# Altium schematic sheet LAUNCHXL-F28379D_6.SchDoc
size 301 x 239 mm
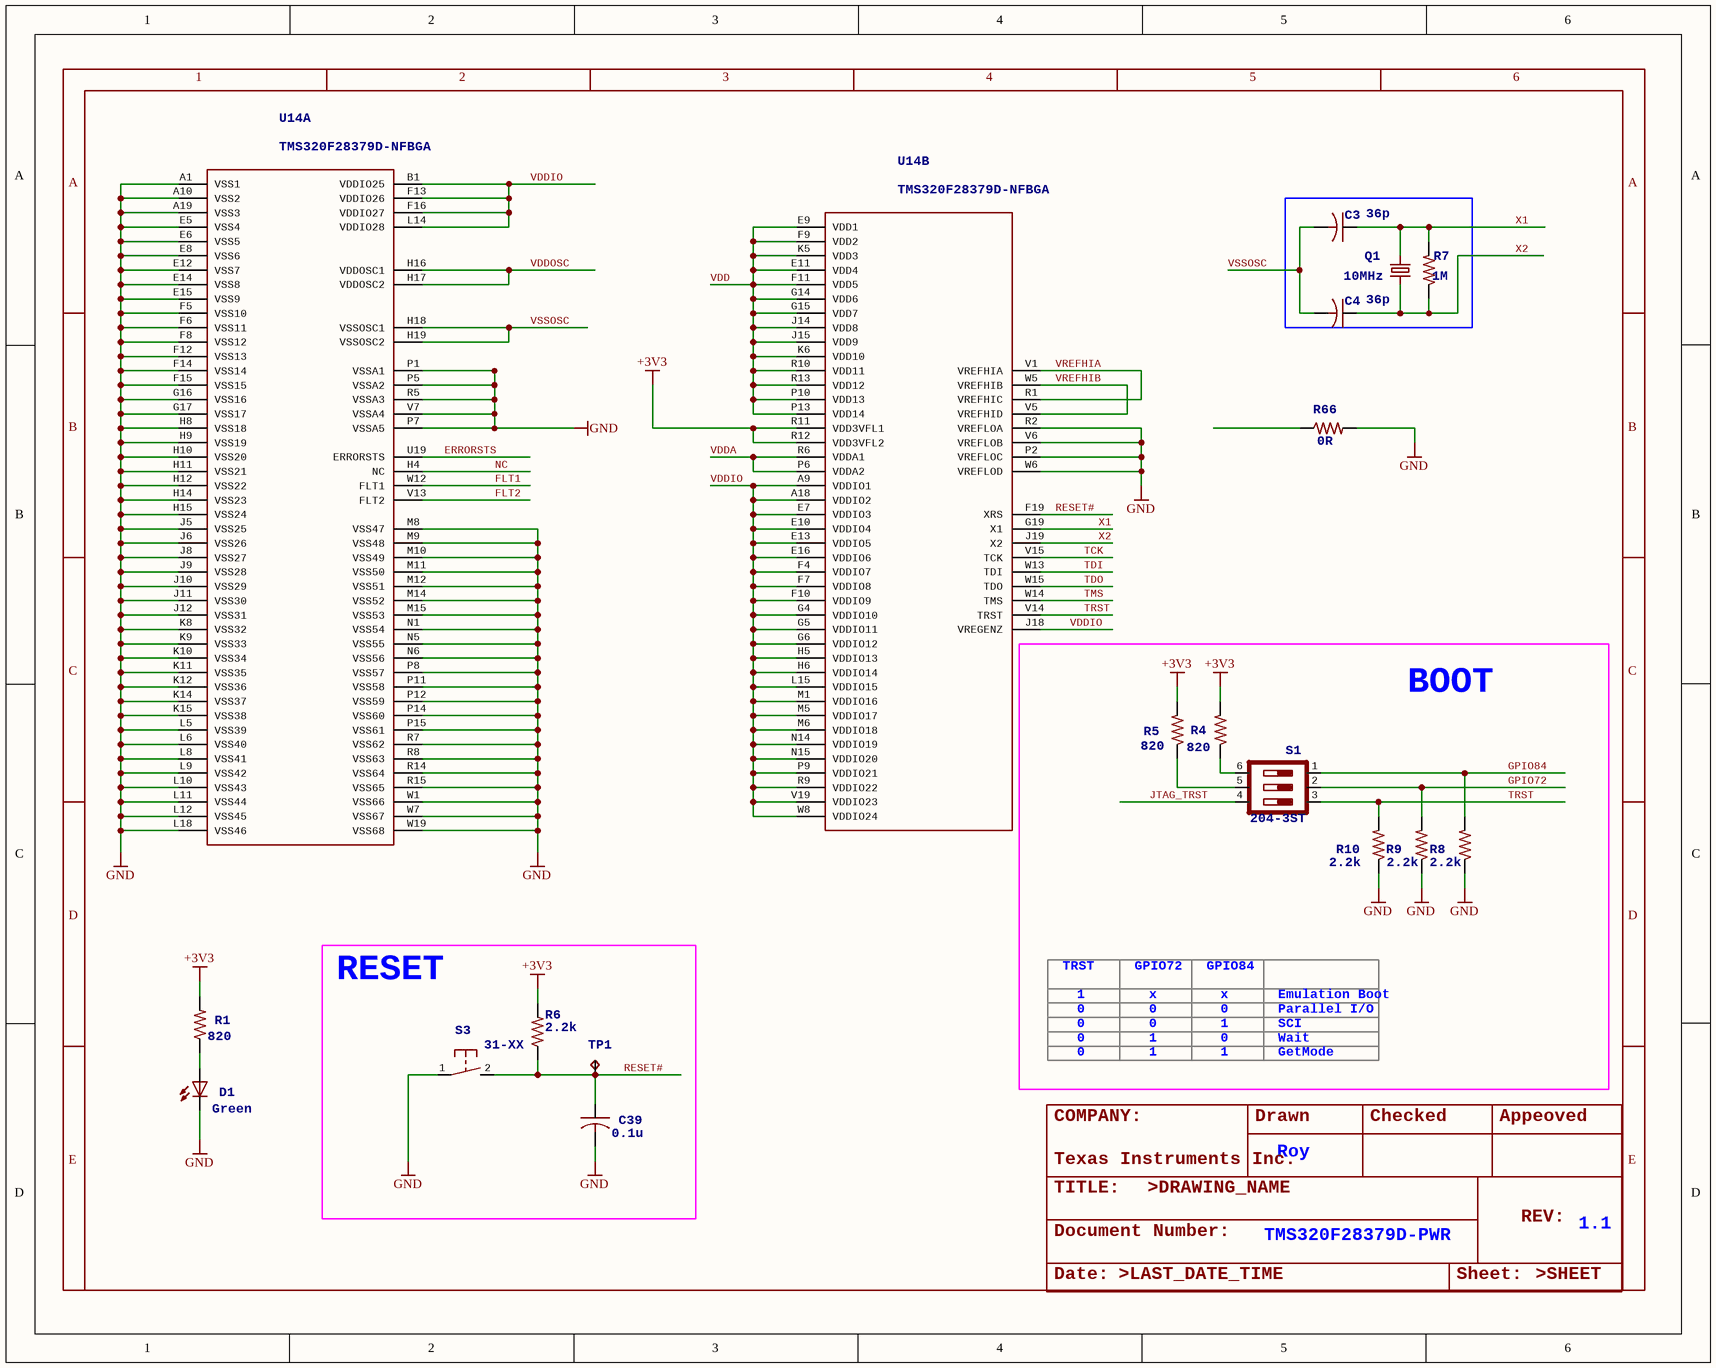
[diagram p0: LAUNCHXL-F28379D_6.SchDoc]

## Parts
C3  36p  [C0402]
C4  36p  [C0402]
C39  0.1u  [C0402]
D1  Green  [CHIP-LED0603]
Q1  10MHz  [HC49/S]
R1  820  [R0402]
R4  820  [R0402]
R5  820  [R0402]
R6  2.2k  [R0402]
R7  1M  [R0402]
R8  2.2k  [R0402]
R9  2.2k  [R0402]
R10  2.2k  [R0402]
R66  0R  [R0402]
S1  204-3ST  [CTS-219-03]
S3  31-XX  [B3F-31XX]
TP1  TESTPAD_TPB1,27  [TESTPAD_B1,27]  (value not drawn)
U14  TMS320F28379D-NFBGA  [BGA_F28079]  (parts A,B of 5)

## Blocks framed on the sheet
BOOT: R4 R5 R8-R10 S1
RESET: C39 R6 S3 TP1

## Nets
+3V3: R1.2 R4.2 R5.2 R6.2 U14.R11(VDD3VFL1) U14.R12(VDD3VFL2)
GND: C39.2 D1.C R8.1 R9.1 R10.1 R66.2 S3.1(P) U14.A1(VSS1) U14.A10(VSS2) U14.A19(VSS3) U14.E5(VSS4) U14.E6(VSS5) U14.E8(VSS6) U14.E12(VSS7) U14.E14(VSS8) U14.E15(VSS9) U14.F5(VSS10) U14.F6(VSS11) U14.F8(VSS12) U14.F12(VSS13) U14.F14(VSS14) U14.F15(VSS15) U14.G16(VSS16) U14.G17(VSS17) U14.H8(VSS18) U14.H9(VSS19) U14.H10(VSS20) U14.H11(VSS21) U14.H12(VSS22) U14.H14(VSS23) U14.H15(VSS24) U14.J5(VSS25) U14.J6(VSS26) U14.J8(VSS27) U14.J9(VSS28) U14.J10(VSS29) U14.J11(VSS30) U14.J12(VSS31) U14.K8(VSS32) U14.K9(VSS33) U14.K10(VSS34) U14.K11(VSS35) U14.K12(VSS36) U14.K14(VSS37) U14.K15(VSS38) U14.L5(VSS39) U14.L6(VSS40) U14.L8(VSS41) U14.L9(VSS42) U14.L10(VSS43) U14.L11(VSS44) U14.L12(VSS45) U14.L18(VSS46) U14.M8(VSS47) U14.M9(VSS48) U14.M10(VSS49) U14.M11(VSS50) U14.M12(VSS51) U14.M14(VSS52) U14.M15(VSS53) U14.N1(VSS54) U14.N5(VSS55) U14.N6(VSS56) U14.P1(VSSA1) U14.P2(VREFLOC) U14.P5(VSSA2) U14.P7(VSSA5) U14.P8(VSS57) U14.P11(VSS58) U14.P12(VSS59) U14.P14(VSS60) U14.P15(VSS61) U14.R2(VREFLOA) U14.R5(VSSA3) U14.R7(VSS62) U14.R8(VSS63) U14.R14(VSS64) U14.R15(VSS65) U14.V6(VREFLOB) U14.V7(VSSA4) U14.W1(VSS66) U14.W6(VREFLOD) U14.W7(VSS67) U14.W19(VSS68)
ERRORSTS: U14.U19(ERRORSTS)
FLT1: U14.W12(FLT1)
FLT2: U14.V13(FLT2)
GPIO72: R9.2 S1.2
GPIO84: R8.2 S1.1
JTAG_TRST: S1.4
NC: U14.H4(NC)
RESET#: C39.1 R6.1 S3.2(S) TP1.TP U14.F19(XRS)
TCK: U14.V15(TCK)
TDI: U14.W13(TDI)
TDO: U14.W15(TDO)
TMS: U14.W14(TMS)
TRST: R10.2 S1.3 U14.V14(TRST)
VDD: U14.E9(VDD1) U14.E11(VDD4) U14.F9(VDD2) U14.F11(VDD5) U14.G14(VDD6) U14.G15(VDD7) U14.J14(VDD8) U14.J15(VDD9) U14.K5(VDD3) U14.K6(VDD10) U14.P10(VDD13) U14.P13(VDD14) U14.R10(VDD11) U14.R13(VDD12)
VDDA: U14.P6(VDDA2) U14.R6(VDDA1)
VDDIO: U14.A9(VDDIO1) U14.A18(VDDIO2) U14.B1(VDDIO25) U14.E7(VDDIO3) U14.E10(VDDIO4) U14.E13(VDDIO5) U14.E16(VDDIO6) U14.F4(VDDIO7) U14.F7(VDDIO8) U14.F10(VDDIO9) U14.F13(VDDIO26) U14.F16(VDDIO27) U14.G4(VDDIO10) U14.G5(VDDIO11) U14.G6(VDDIO12) U14.H5(VDDIO13) U14.H6(VDDIO14) U14.J18(VREGENZ) U14.L14(VDDIO28) U14.L15(VDDIO15) U14.M1(VDDIO16) U14.M5(VDDIO17) U14.M6(VDDIO18) U14.N14(VDDIO19) U14.N15(VDDIO20) U14.P9(VDDIO21) U14.R9(VDDIO22) U14.V19(VDDIO23) U14.W8(VDDIO24)
VDDOSC: U14.H16(VDDOSC1) U14.H17(VDDOSC2)
VREFHIA: U14.R1(VREFHIC) U14.V1(VREFHIA)
VREFHIB: U14.V5(VREFHID) U14.W5(VREFHIB)
VSSOSC: C3.2 C4.2 U14.H18(VSSOSC1) U14.H19(VSSOSC2)
X1: C3.1 Q1.2 R7.2 U14.G19(X1)
X2: C4.1 Q1.1 R7.1 U14.J19(X2)
NetD1_A: D1.A R1.1
NetR4_1: R4.1 S1.6
NetR5_1: R5.1 S1.5

Not connected (* = marked no-connect by the designer): R66 1

## Notes on the sheet
- TRST
- 1
- 0
- GPIO72
- x
- GPIO84
- Emulation Boot
- Parallel I/O
- SCI
- Wait
- GetMode
- COMPANY:
- Texas
  Instruments Inc.
- Drawn
- Roy
- Checked
- Appeoved
- TITLE:
- Document Number:
- >DRAWING_NAME
- TMS320F28379D-PWR
- REV:
- 1.1
- Date:
- >LAST_DATE_TIME
- Sheet:
- >SHEET
- 2
- 3
- 4
- 5
- 6
- A
- B
- C
- D
- E

## Library data of the parts
C3 C4 C39 = C-USC0402: <B>CAPACITOR</B>, American symbol
D1 = LEDCHIP-LED0603: <b>LED</b><p> / <u>OSRAM</u>:<br> / - <u>CHIPLED</u><br> / LG R971, LG N971, LY N971, LG Q971, LY Q971, LO R971, LY R971 / LH N974, LH R974<br> / LS Q976, LO Q976, LY Q976<br> / LO Q996<br> / - <u>Hyper CHIPLED</u><br> / LW Q18S<br> / LB Q993, LB Q99A, LB R99A<br> / - <u>SideLED</u><br> / LS A670, LO A670, LY A670, LG A670, LP A670<br> / LB A673, LV A673, LT A673, LW A673<br> / LH A674<br> / LY A675<br> / LS A676, LA A676, LO A676, LY A676, LW A676<br> / LS A679, LY A679, LG A679<br> / -  <u>Hyper Micro SIDELED®</u><br> / LS Y876, LA Y876, LO Y876, LY Y876<br> / LT Y87S<br> / - <u>SmartLED</u><br> / LW L88C, LW L88S<br> / LB L89C, LB L89S, LG L890<br> / LS L89K, LO L89K, LY L89K<br> / LS L896, LA L896, LO L896, LY L896<br> / - <u>TOPLED</u><br> / LS T670, LO T670, LY T670, LG T670, LP T670<br> / LSG T670, LSP T670, LSY T670, LOP T670, LYG T670<br> / LG T671, LOG T671, LSG T671<br> / LB T673, LV T673, LT T673, LW T673<br> / LH T674<br> / LS T676, LA T676, LO T676, LY T676, LB T676, LH T676, LSB T676, LW T676<br> / LB T67C, LV T67C, LT T67C, LS T67K, LO T67K, LY T67K, LW E67C<br> / LS E67B, LA E67B, LO E67B, LY E67B, LB E67C, LV E67C, LT E67C<br> / LW T67C<br> / LS T679, LY T679, LG T679<br> / LS T770, LO T770, LY T770, LG T770, LP T770<br> / LB T773, LV T773, LT T773, LW T773<br> / LH T774<br> / LS E675, LA E675, LY E675, LS T675<br> / LS T776, LA T776, LO T776, LY T776, LB T776<br> / LHGB T686<br> / LT T68C, LB T68C<br> / - <u>Hyper Mini TOPLED®</u><br> / LB M676<br> / - <u>Mini TOPLED Santana®</u><br> / LG M470<br> / LS M47K, LO M47K, LY M47K / <p> / Source: http://www.osram.convergy.de<p> / <u>LUXEON:</u><br> / - <u>LUMILED®</u><br> / LXK2-PW12-R00, LXK2-PW12-S00, LXK2-PW14-U00, LXK2-PW14-V00<br> / LXK2-PM12-R00, LXK2-PM12-S00, LXK2-PM14-U00<br> / LXK2-PE12-Q00, LXK2-PE12-R00, LXK2-PE12-S00, LXK2-PE14-T00, LXK2-PE14-U00<br> / LXK2-PB12-K00, LXK2-PB12-L00, LXK2-PB12-M00, LXK2-PB14-N00, LXK2-PB14-P00, LXK2-PB14-Q00<br> / LXK2-PR12-L00, LXK2-PR12-M00, LXK2-PR14-Q00, LXK2-PR14-R00<br> / LXK2-PD12-Q00, LXK2-PD12-R00, LXK2-PD12-S00<br> / LXK2-PH12-R00, LXK2-PH12-S00<br> / LXK2-PL12-P00, LXK2-PL12-Q00, LXK2-PL12-R00 / <p> / Source: www.luxeon.com<p> / <u>KINGBRIGHT:</U><p> / KA-3528ASYC<br> / Source: www.kingbright.com
Q1 = CRYSTALHC49S: <b>CRYSTAL</b>
R1 R4-R10 R66 = R-US_R0402: <B>RESISTOR</B>, American symbol
S1 = 219-03*: <b>Surface Mount DIP Switch Series 219 SMT</b><p> / CTS Electronic Components<br> / Sourc: www.ctscorp.com
S3 = 31-XX: <b>OMRON SWITCH</b>
TP1 = TESTPAD_TPB1,27: <b>Test pad</b>